# Altium project power_board.PrjPcb (part 2 of 6)

## Sheet DC_DC_MPPT.SchDoc
size A4; SheetNumber: 3; SheetTotal: 9
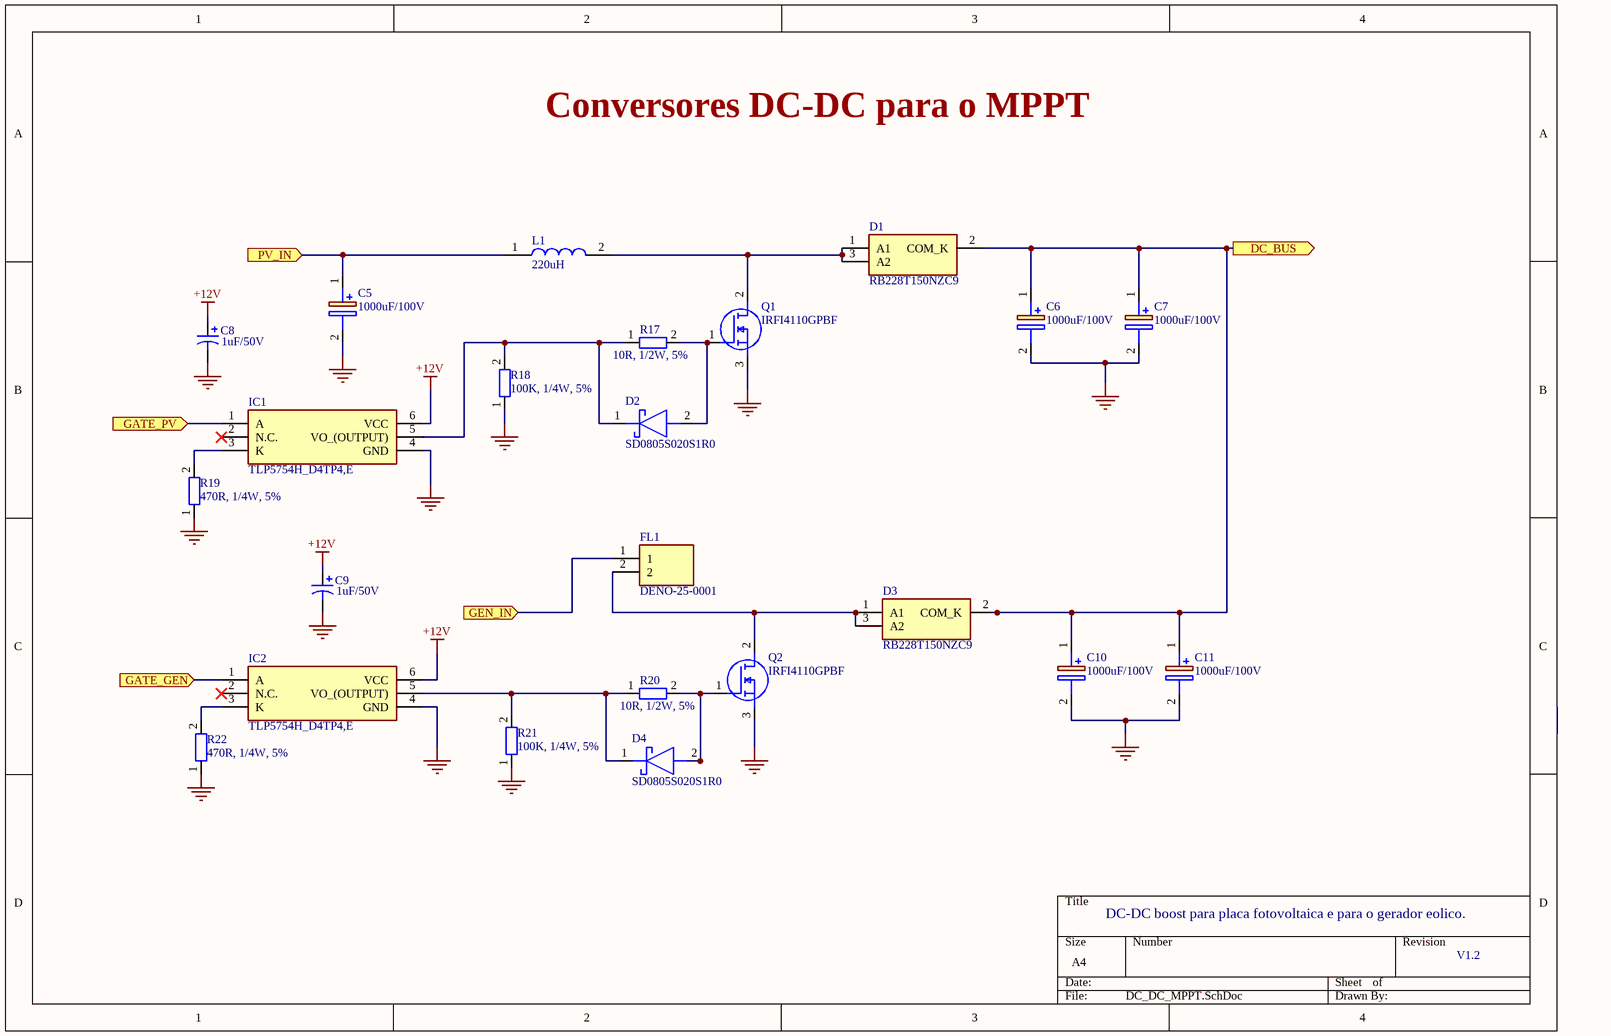
[diagram p2: DC_DC_MPPT.SchDoc]

### Parts
C5  1000uF/100V  [CAPPRD750W85D1800H3750]
C6  1000uF/100V  [CAPPRD750W85D1800H3750]
C7  1000uF/100V  [CAPPRD750W85D1800H3750]
C8  value 1uF/50V  [C1206]  (hidden comment: Cap Pol1)
C9  value 1uF/50V  [C1206]  (hidden comment: Cap Pol1)
C10  1000uF/100V  [CAPPRD750W85D1800H3750]
C11  1000uF/100V  [CAPPRD750W85D1800H3750]
D1  RB228T150NZC9  [TO254P480X1010X2100-3P]
D2  SD0805S020S1R0  [DIOM1613X100N]
D3  RB228T150NZC9  [TO254P480X1010X2100-3P]
D4  SD0805S020S1R0  [DIOM1613X100N]
FL1  DENO-25-0001  [DENO250001]
IC1  TLP5754H_D4TP4,E  [SOIC127P1105X230-6N]
IC2  TLP5754H_D4TP4,E  [SOIC127P1105X230-6N]
L1  220uH  [1140221KRC]
Q1  IRFI4110GPBF  [TO254P483X1018X2095-3P]
Q2  IRFI4110GPBF  [TO254P483X1018X2095-3P]
R17  10R, 1/2W, 5%  [RESC3216X60N]
R18  100K, 1/4W, 5%  [RES-0805]
R19  470R, 1/4W, 5%  [RES-0805]
R20  10R, 1/2W, 5%  [RESC3216X60N]
R21  100K, 1/4W, 5%  [RES-0805]
R22  470R, 1/4W, 5%  [RES-0805]

### Ports
DC_BUS (out), GATE_GEN (in), GATE_PV (in), GEN_IN (in), PV_IN (in)

### Nets
+12V: C8.1 C9.1 IC1.6(VCC) IC2.6(VCC)
GND: C5.2(-) C6.2(-) C7.2(-) C8.2 C9.2 C10.2(-) C11.2(-) IC1.4(GND) IC2.4(GND) Q1.3(S) Q2.3(S) R18.1 R19.1 R21.1 R22.1
DC BUS: C6.1(+) C7.1(+) C10.1(+) C11.1(+) D1.2(COM_K) D3.2(COM_K) ; port DC_BUS
NetC5_1: C5.1(+) L1.1 ; port PV_IN
NetD1_1: D1.1(A1) D1.3(A2) L1.2 Q1.2(D)
NetD2_1: D2.1(K) IC1.5(VO_(OUTPUT)) R17.1 R18.2
NetD2_2: D2.2(A) Q1.1(G) R17.2
NetD3_1: D3.1(A1) D3.3(A2) FL1.2 Q2.2(D)
NetD4_1: D4.1(K) IC2.5(VO_(OUTPUT)) R20.1 R21.2
NetD4_2: D4.2(A) Q2.1(G) R20.2
NetFL1_1: FL1.1 ; port GEN_IN
NetIC1_1: IC1.1(A) ; port GATE_PV
NetIC1_3: IC1.3(K) R19.2
NetIC2_1: IC2.1(A) ; port GATE_GEN
NetIC2_3: IC2.3(K) R22.2

Not connected (* = marked no-connect by the designer): IC1 2(N.C.)*; IC2 2(N.C.)*

### Notes on the sheet
- Conversores DC-DC para o MPPT
- DC-DC boost para placa fotovoltaica e para o gerador eolico.
- V1.2

### Library data of the parts
C5-C7 C10 C11 = ECA-2AHG102: Aluminum Electrolytic Capacitors - Leaded 1000uF 100V; Manufacturer_Name: Panasonic; Capacitance: 1mF; Tolerance: 20%; Ripple Current: 985mA; Leakage Current: 3uA; Life (Hours): 2000Hour; Dissipation Factor: 0.08%; Lead/Base Style: Straight; Lead Diameter: 0.8mm; Datasheet Link: http://www.mouser.com/ds/2/315/ABA0000C1215-1109177.pdf; Height: 37.5mm; Manufacturer_Part_Number: ECA-2AHG102; Mouser Part Number: 667-ECA-2AHG102; Mouser Price/Stock: https://www.mouser.co.uk/ProductDetail/Panasonic/ECA-2AHG102/?qs=rrcJgg%2Fw9KxYcZZHtVYgiQ%3D%3D; Arrow Part Number: ECA-2AHG102; Arrow Price/Stock: https://www.arrow.com/en/products/eca-2ahg102/panasonic; Supplier 1: Mouser; Supplier Part Number 1: 667-ECA-2AHG102; Manufacturer: Panasonic; Manufacturer Part Number: ECA-2AHG102; RoHS: Yes; Category: Aluminum Electrolytic Capacitors; Stock 1: 994; Pricing 1: 1=2.62000, 10=1.75000, 50=1.75000, 100=1.60000, 1000=1.07000, 10000=1.07000 (USD); Mount: Through Hole,PCB; Case/Package: Radial; Number of Pins: 2; Contact Plating: Tin; Min Operating Temperature: -55°C; Max Operating Temperature: 105°C; Termination: Radial; Voltage Rating: 100V; Packaging: Bulk; Package Quantity: 50; Voltage Rating (DC): 100V; Voltage: 100V; Series: NHG; Construction: RADIAL; Diameter: 18mm; Length: 35.5mm; Width: 18mm; Lead Pitch: 7.5mm; Height - Seated (Max): 1.476inch; Radiation Hardening: No; REACH SVHC: No SVHC; Lead Free: Lead Free; RoHS Compliant: Yes; ComponentLink1URL: https://datasheet.ciiva.com/2984/aba0000ce26-2984390.pdf?src-supplier=Avnet; ComponentLink1Description: https://datasheet.ciiva.com/2984/aba0000ce26-2984390.pdf?src-supplier=Avnet; ComponentLink2URL: https://datasheet.ciiva.com/43459/1790596-43459676.pdf?src-supplier=Farnell; ComponentLink2Description: https://datasheet.ciiva.com/43459/1790596-43459676.pdf?src-supplier=Farnell; ComponentLink3URL: https://datasheet.ciiva.com/24027/aba0000ce26-372437-24027279.pdf?src-supplier=Mouser; ComponentLink3Description: https://datasheet.ciiva.com/24027/aba0000ce26-372437-24027279.pdf?src-supplier=Mouser; ComponentLink4URL: https://datasheet.ciiva.com/30158/8aba0000ce26-30158524.pdf?src-supplier=Onlinecomponents.com; ComponentLink4Description: https://datasheet.ciiva.com/30158/8aba0000ce26-30158524.pdf?src-supplier=Onlinecomponents.com; ComponentLink5URL: https://datasheet.ciiva.com/16387/aba0000ce26-16387053.pdf?src-supplier=Future+Electronics; ComponentLink5Description: https://datasheet.ciiva.com/16387/aba0000ce26-16387053.pdf?src-supplier=Future+Electronics; ComponentLink6URL: https://datasheet.ciiva.com/14594/70067776-14594090.pdf?src-supplier=Allied+Electronics; ComponentLink6Description: https://datasheet.ciiva.com/14594/70067776-14594090.pdf?src-supplier=Allied+Electronics; ComponentLink7URL: https://datasheet.ciiva.com/15198/getdatasheetpartid-470872-15198006.pdf?src-supplier=Verical; ComponentLink7Description: https://datasheet.ciiva.com/15198/getdatasheetpartid-470872-15198006.pdf?src-supplier=Verical; ComponentLink8URL: https://datasheet.ciiva.com/17533/aba0000ce26-17533421.pdf?src-supplier=Avnet+Europe; ComponentLink8Description: https://datasheet.ciiva.com/17533/aba0000ce26-17533421.pdf?src-supplier=Avnet+Europe; ComponentLink9URL: https://datasheet.ciiva.com/29248/792491-da-01-en-elko-nhg-r-1000uf-100v-105c-29248620.pdf?src-supplier=Conrad; ComponentLink9Description: https://datasheet.ciiva.com/29248/792491-da-01-en-elko-nhg-r-1000uf-100v-105c-29248620.pdf?src-supplier=Conrad
C8 C9 = Cap Pol1: KEMET         T491A105K050AT            Surface Mount Tantalum Capacitor, T491 Series, 1 F,  10%, 50 V, 1206 [3216 Metric], A; Capacitance: 1uF; ESR (Equivalent Series Resistance): 7R; Voltage Rating: 50V; Polarity: Polar; Dissipation Factor: 4%; Published: 8-Jun-2000; LatestRevisionDate: 17-Jul-2002; LatestRevisionNote: Re-released for DXP Platform.; PackageReference: RB7.6-15; Publisher: Altium Limited; PackageDescription: Polarized Capacitor (Radial); 2 Leads; Supplier 1: Mouser; Supplier Part Number 1: 80-T491A105K050AT; Manufacturer: KEMET; Manufacturer Part Number: T491A105K050AT; RoHS: Yes; Category: Tantalum Capacitors; Stock 1: 5526; Pricing 1: 1=0.86000, 10=0.53600, 50=0.53600, 100=0.37800, 1000=0.31600, 10000=0.24700 (USD); Case/Package: Molded; Case Code (Metric): 3216; Case Code (Imperial): 1206; Min Operating Temperature: -55°C; Max Operating Temperature: 125°C; Tolerance: 10%; Packaging: Cut Tape; Voltage Rating (DC): 50V; Length: 3.2mm; Depth: 1.6mm; REACH SVHC: No SVHC; Lead Free: Lead Free; RoHS Compliant: Yes; ComponentLink1URL: https://datasheet.ciiva.com/7972/1854511-7972911.pdf?src-supplier=Element14; ComponentLink1Description: https://datasheet.ciiva.com/7972/1854511-7972911.pdf?src-supplier=Element14
D1 D3 = RB228T150NZC9: Schottky Diode; Manufacturer_Name: ROHM Semiconductor; Manufacturer: Rohm; Datasheet Link: https://fscdn.rohm.com/en/products/databook/datasheet/discrete/diode/schottky_barrier/rb228t150nz-e.pdf; Height: 4.8mm; Manufacturer_Part_Number: RB228T150NZC9; Supplier 1: Mouser; Supplier Part Number 1: 755-RB228T150NZC9; Manufacturer Part Number: RB228T150NZC9; RoHS: Yes; Stock 1: 962; Pricing 1: 1=1.74000, 10=1.48000, 50=1.48000, 100=1.14000, 1000=0.82400, 10000=0.78200 (USD)
D2 D4 = SD0805S020S1R0: Schottky Diodes & Rectifiers 20volts 1A SIZE 0805; Manufacturer_Name: AVX; Manufacturer: Kyocera AVX; Max Surge Current: 10A; Forward Voltage: 450mV; Max Reverse Current: 200uA; Max Repetitive Reverse Voltage (Vrrm): 20V; Element Configuration: Single; Datasheet Link: https://componentsearchengine.com/Datasheets/1/SD0805S020S1R0.pdf; Height: 1mm; Manufacturer_Part_Number: SD0805S020S1R0; Mouser Part Number: 581-SD0805S020S1R0; Mouser Price/Stock: https://www.mouser.co.uk/ProductDetail/AVX/SD0805S020S1R0/?qs=jCA%252BPfw4LHbpkAoSnwrdjw%3D%3D; Arrow Part Number: SD0805S020S1R0; Arrow Price/Stock: https://www.arrow.com/en/products/sd0805s020s1r0/avx; Supplier 1: Mouser; Supplier Part Number 1: 581-SD0805S020S1R0; Manufacturer Part Number: SD0805S020S1R0; RoHS: Yes; Category: Rectifier Diodes; Stock 1: 14821; Pricing 1: 1=0.38000, 10=0.29100, 50=0.29100, 100=0.17800, 1000=0.11300, 10000=0.08700 (USD); Mount: Surface Mount; Case/Package: 0805; Number of Pins: 2; Case Code (Metric): 2012; Case Code (Imperial): 0805; Min Operating Temperature: -55°C; Max Operating Temperature: 125°C; Packaging: Tape and Reel; Package Quantity: 3000; Forward Current: 1A; Average Rectified Current: 1A; Max Reverse Leakage Current: 200uA; Max Forward Surge Current (Ifsm): 10A; Peak Non-Repetitive Surge Current: 10A; Max Reverse Voltage (DC): 20V; Series: -; Radiation Hardening: No; REACH SVHC: No SVHC; RoHS Compliant: Yes; ComponentLink1URL: https://datasheet.ciiva.com/29883/schottky-29883740.pdf?src-supplier=Avnet; ComponentLink1Description: https://datasheet.ciiva.com/29883/schottky-29883740.pdf?src-supplier=Avnet; ComponentLink2URL: https://datasheet.ciiva.com/29883/schottky-29883741.pdf?src-supplier=Avnet; ComponentLink2Description: https://datasheet.ciiva.com/29883/schottky-29883741.pdf?src-supplier=Avnet; ComponentLink3URL: https://datasheet.ciiva.com/13084/schottky-221155-13084174.pdf?src-supplier=Mouser; ComponentLink3Description: https://datasheet.ciiva.com/13084/schottky-221155-13084174.pdf?src-supplier=Mouser
FL1 = DENO-25-0001: Fixed Inductors DENO Grnd wire choke 16A; Manufacturer_Name: SCHURTER; DC Resistance (DCR): 27mR; Inductance: 4mH; Lead/Base Style: Radial; Self Resonant Frequency: 300kHz; Shielding: Unshielded; Number of Lines: 1; Lead Diameter: 1.12mm; Datasheet Link: https://www.mouser.com/datasheet/2/358/typ_DENO-1276019.pdf; Height: 25mm; Manufacturer_Part_Number: DENO-25-0001; Mouser Part Number: 693-DENO-25-0001; Mouser Price/Stock: https://www.mouser.co.uk/ProductDetail/Schurter/DENO-25-0001?qs=A5k8bsa1loDfpdVSyZOXZg%3D%3D; Arrow Part Number: DENO-25-0001; Arrow Price/Stock: https://www.arrow.com/en/products/deno-25-0001/schurter; Supplier 1: Mouser; Supplier Part Number 1: 693-DENO-25-0001; Manufacturer: Schurter; Manufacturer Part Number: DENO-25-0001; RoHS: Yes; Category: Fixed Inductors; Stock 1: 326; Pricing 1: 1=4.79000, 10=4.25000, 50=3.83000, 100=3.62000, 1000=2.98000, 10000=2.87000 (USD); Mount: Through Hole,Radial; Case/Package: Radial; Weight: 0.83952oz; Min Operating Temperature: -25°C; Max Operating Temperature: 100°C; Max DC Current: 16A; Package Quantity: 50; Current Rating: 16A; Packaging: Bulk; Max Current Rating: 16A; DC Current: 16A; Termination: Radial; Series: DENO; Diameter: 25mm; Length: 0.984inch; Width: 0.709inch; Depth: 18mm; Radiation Hardening: No; Military Standard: Not; Lead Free: Lead Free; RoHS Compliant: Yes; ComponentLink1URL: https://datasheet.ciiva.com/25456/1832736-25456284.pdf?src-supplier=Newark; ComponentLink1Description: https://datasheet.ciiva.com/25456/1832736-25456284.pdf?src-supplier=Newark; ComponentLink2URL: https://datasheet.ciiva.com/17249/typ-deno-17249423.pdf?src-supplier=Avnet+Europe; ComponentLink2Description: https://datasheet.ciiva.com/17249/typ-deno-17249423.pdf?src-supplier=Avnet+Europe; ComponentLink3URL: https://datasheet.ciiva.com/6708/typ-deno-6708408.pdf?src-supplier=Digi-Key; ComponentLink3Description: https://datasheet.ciiva.com/6708/typ-deno-6708408.pdf?src-supplier=Digi-Key
IC1 IC2 = TLP5754H_D4TP4,E: Integrated Circuit; Manufacturer_Name: Toshiba; Manufacturer_Part_Number: TLP5754H(D4TP4,E; Datasheet Link: https://toshiba.semicon-storage.com/; Height: 2.3mm; Mouser Part Number: 757-TLP5754HD4TP4E; Mouser Price/Stock: https://www.mouser.co.uk/ProductDetail/Toshiba/TLP5754HD4TP4E?qs=BJlw7L4Cy78tX5u9MwNqOg%3D%3D; Supplier 1: Mouser; Supplier Part Number 1: 757-TLP5754HD4TP4E; Manufacturer: Toshiba; Manufacturer Part Number: TLP5754H(D4TP4,E; RoHS: Yes; Stock 1: 2749; Pricing 1: 1=2.13000, 10=1.86000, 50=1.83000, 100=1.09000, 1000=0.95600, 10000=0.73200 (USD)
L1 = 1140-221K-RC: BOURNS JW MILLER         1140-221K-RC             HIGH CURRENT CHOKE, 220UH 11.4A 10%; Core Material: Ferrite; Current Rating: 7.4A; Shielding: Unshielded; Saturation Current: 14A; DC Resistance (DCR): 50mR; Test Frequency: 1kHz; Lead/Base Style: Radial; Lead Diameter: 0.057inch; Lead Length: 12.7mm; Datasheet Link: https://www.mouser.com/datasheet/2/54/1140_series-776825.pdf; Height: 26.162mm; Manufacturer_Name: Bourns; Manufacturer_Part_Number: 1140-221K-RC; Mouser Part Number: 542-1140-221K-RC; Mouser Price/Stock: https://www.mouser.co.uk/ProductDetail/Bourns/1140-221K-RC?qs=Pac2tMOelJAp1Q7rw4D2Wg%3D%3D; Arrow Part Number: 1140-221K-RC; Arrow Price/Stock: https://www.arrow.com/en/products/1140-221k-rc/bourns; Supplier 1: Mouser; Manufacturer: Bourns JW Miller; Manufacturer Part Number: 1140-221K-RC; RoHS: Yes; Category: Fixed Inductors; Stock 1: 476; Pricing 1: 1=8.31000, 10=7.34000, 50=6.41000, 100=6.21000, 1000=5.66000, 10000=5.66000 (USD); Mount: Through Hole; Case/Package: Radial; Contact Plating: Tin; Min Operating Temperature: -55°C; Max Operating Temperature: 105°C; Packaging: Bulk; Tolerance: 10%; Inductance Tolerance: 10%; Package Quantity: 70; Resistor Type: Wirewound; Inductance: 220uH; Max DC Current: 11.4A; Termination: Radial; DC Current: 11.4A; RMS Current (Irms): 7.4A; Series: 1140; Diameter: 1.5inch; Length: 1.03inch; Lead Pitch: 29.21mm; Height - Seated (Max): 1.03inch; REACH SVHC: No SVHC; Military Standard: Not; Lead Free: Lead Free; ComponentLink1URL: https://datasheet.ciiva.com/13283/1140-series-61680-13283934.pdf?src-supplier=Mouser; ComponentLink1Description: https://datasheet.ciiva.com/13283/1140-series-61680-13283934.pdf?src-supplier=Mouser; ComponentLink2URL: https://datasheet.ciiva.com/5839/1140-series-5839095.pdf?src-supplier=Farnell; ComponentLink2Description: https://datasheet.ciiva.com/5839/1140-series-5839095.pdf?src-supplier=Farnell; ComponentLink3URL: https://datasheet.ciiva.com/6690/1140-series-6690681.pdf?src-supplier=Digi-Key; ComponentLink3Description: https://datasheet.ciiva.com/6690/1140-series-6690681.pdf?src-supplier=Digi-Key; ComponentLink4URL: https://datasheet.ciiva.com/30231/8931140-series-30231343.pdf?src-supplier=Onlinecomponents.com; ComponentLink4Description: https://datasheet.ciiva.com/30231/8931140-series-30231343.pdf?src-supplier=Onlinecomponents.com; ComponentLink5URL: https://datasheet.ciiva.com/1474/1140-series-1474528.pdf?src-supplier=Element14; ComponentLink5Description: https://datasheet.ciiva.com/1474/1140-series-1474528.pdf?src-supplier=Element14; Supplier Part Number 1: 542-1140-221K-RC
Q1 Q2 = IRFI4110GPBF: MOSFET N-CH 100V 72A TO220AB; Manufacturer_Name: Infineon; Rds On Max: 4.5mR; Input Capacitance: 9.54nF; Max Power Dissipation: 61W; Threshold Voltage: 4V; Datasheet Link: https://www.mouser.co.uk/datasheet/2/196/Infineon-IRFI4110G-DS-v01_02-EN-1227339.pdf; Height: 4.83mm; Manufacturer_Part_Number: IRFI4110GPBF; Mouser Part Number: 942-IRFI4110GPBF; Mouser Price/Stock: https://www.mouser.com/Search/Refine.aspx?Keyword=942-IRFI4110GPBF; Arrow Part Number: IRFI4110GPBF; Arrow Price/Stock: https://www.arrow.com/en/products/irfi4110gpbf/infineon-technologies-ag; Supplier 1: Mouser; Supplier Part Number 1: 942-IRFI4110GPBF; Manufacturer: Infineon; Manufacturer Part Number: IRFI4110GPBF; RoHS: Yes; Category: MOSFETs; Stock 1: 2175; Pricing 1: 1=3.400000, 10=2.890000, 100=2.310000, 500=2.060000, 1000=1.840000, 2000=1.840000 (USD); Mount: Through Hole; Case/Package: TO-220-3; Number of Pins: 3; Min Operating Temperature: -55°C; Max Operating Temperature: 175°C; Continuous Drain Current (ID): 72A; Packaging: Rail/Tube; Drain to Source Voltage (Vdss): 100V; Max Dual Supply Voltage: 100V; REACH SVHC: No SVHC; Lead Free: Lead Free; RoHS Compliant: Yes; Halogen Free: Halogen Free; ComponentLink1URL: http://www.infineon.com/dgdl/irfi4110gpbf.pdf?fileId=5546d462533600a401535623f28d1f78&src-supplier=Digi-Key; ComponentLink1Description: http://www.infineon.com/dgdl/irfi4110gpbf.pdf?fileId=5546d462533600a401535623f28d1f78&src-supplier=Digi-Key; ComponentLink2URL: http://www.farnell.com/datasheets/1302157.pdf?src-supplier=Element14; ComponentLink2Description: http://www.farnell.com/datasheets/1302157.pdf?src-supplier=Element14
R17 R20 = RES-1206: Res Thick Film 0805 10 Ohm 5% 0.5W(1/2W) +/-200ppm/C Pad SMD Automotive T/R; Manufacturer: Vishay Dale; Manufacturer Part Number: CRCW080510R0JNEAHP; Temperature Coefficient: 200ppm/°C; Power Rating: 330mW; Voltage Rating: 150V; Max Power Dissipation: 333mW; Supplier 1: Mouser; Supplier Part Number 1: 71-CRCW080510R0JNEAH; RoHS: Yes; Category: Chip SMD Resistors; Stock 1: 4777; Pricing 1: 1=0.23000, 10=0.20300, 50=0.20300, 100=0.07900, 1000=0.03000, 10000=0.02700 (USD); Mount: Surface Mount; Case/Package: 0805; Contact Plating: Tin; Weight: 0.000194oz; Case Code (Metric): 2012; Case Code (Imperial): 0805; Min Operating Temperature: -55°C; Max Operating Temperature: 155°C; Resistance: 10R; Tolerance: 5%; Resistor Type: Thick Film; Packaging: Tape and Reel; Package Quantity: 1; Number of Terminations: 2; Features: Automotive AEC-Q200; Series: CRCW-HP; Construction: Rectangular; Length: 2mm; Width: 0.049inch; Height: 0.024inch; Depth: 1.25mm; Radiation Hardening: No; Military Standard: Not; Lead Free: Lead Free; RoHS Compliant: Yes; ComponentLink1URL: https://datasheet.ciiva.com/2499/crcwhpe3-2499490.pdf?src-supplier=Digi-Key; ComponentLink1Description: https://datasheet.ciiva.com/2499/crcwhpe3-2499490.pdf?src-supplier=Digi-Key; ComponentLink2URL: https://datasheet.ciiva.com/2499/crcwhpe3-2499491.pdf?src-supplier=Digi-Key; ComponentLink2Description: https://datasheet.ciiva.com/2499/crcwhpe3-2499491.pdf?src-supplier=Digi-Key; ComponentLink3URL: https://datasheet.ciiva.com/2499/crcwhpe3-2499492.pdf?src-supplier=Digi-Key; ComponentLink3Description: https://datasheet.ciiva.com/2499/crcwhpe3-2499492.pdf?src-supplier=Digi-Key; ComponentLink4URL: https://datasheet.ciiva.com/5562/crcwhpe3-46056-5562181.pdf?src-supplier=Mouser; ComponentLink4Description: https://datasheet.ciiva.com/5562/crcwhpe3-46056-5562181.pdf?src-supplier=Mouser; ComponentLink5URL: https://datasheet.ciiva.com/9050/crcwhpe3-9050566.pdf?src-supplier=Avnet; ComponentLink5Description: https://datasheet.ciiva.com/9050/crcwhpe3-9050566.pdf?src-supplier=Avnet
R18 R21 = Res-0805: Thick Film Resistors 100K OHM 1%; Manufacturer_Name: YAGEO (PHYCOMP); Manufacturer_Part_Number: RC0805JR-131KL; Manufacturer: Yageo; Manufacturer Part Number: RC0805FR-13100KL; Resistance: 100kR; Temperature Coefficient: 100ppm/°C; Power Rating: 125mW; Voltage Rating: 150V; Datasheet Link: http://www.yageo.com/documents/recent/PYu-RC_Group_51_RoHS_L_10.pdf; Height: 0.6mm; Mouser Part Number: 603-RC0805JR-131KL; Mouser Price/Stock: https://www.mouser.com/Search/Refine.aspx?Keyword=603-RC0805JR-131KL; Supplier 1: Mouser; Supplier Part Number 1: 603-RC0805FR-13100KL; RoHS: Yes; Category: Chip SMD Resistors; Stock 1: 57591; Pricing 1: 1=0.13000, 10=0.03100, 50=0.03100, 100=0.01100, 1000=0.00800, 10000=0.00500 (USD); Case/Package: 0805; Contact Plating: Tin,Lead,Matte; Case Code (Imperial): 0805; Case Code (Metric): 2012; Size Code: 0805; Min Operating Temperature: -55°C; Max Operating Temperature: 155°C; Tolerance: 1%; Resistor Type: Thick Film; Packaging: Tape and Reel; Termination: SMD/SMT; Series: RC; Radiation Hardening: No; Lead Free: Lead Free; RoHS Compliant: Yes; ComponentLink1URL: https://datasheet.ciiva.com/5558/rc0805-5558047.pdf?src-supplier=Mouser; ComponentLink1Description: https://datasheet.ciiva.com/5558/rc0805-5558047.pdf?src-supplier=Mouser
R19 R22 = Res-0805: Thick Film Resistors - SMD 470 OHM 5%; Manufacturer_Name: YAGEO (PHYCOMP); Manufacturer_Part_Number: RC0805JR-131KL; Manufacturer: Yageo; Manufacturer Part Number: RC0805JR-13470RL; Temperature Coefficient: 100ppm/°C; Power Rating: 125mW; Voltage Rating: 150V; Datasheet Link: http://www.yageo.com/documents/recent/PYu-RC_Group_51_RoHS_L_10.pdf; Height: 0.6mm; Mouser Part Number: 603-RC0805JR-131KL; Mouser Price/Stock: https://www.mouser.com/Search/Refine.aspx?Keyword=603-RC0805JR-131KL; Supplier 1: Mouser; Supplier Part Number 1: 603-RC0805JR-13470RL; RoHS: Yes; Category: Chip SMD Resistors; Stock 1: 48513; Pricing 1: 1=0.12000, 10=0.01700, 50=0.01700, 100=0.00600, 1000=0.00500, 10000=0.00400 (USD); Case/Package: 0805; Contact Plating: Tin,Matte; Case Code (Imperial): 0805; Case Code (Metric): 2012; Min Operating Temperature: -55°C; Max Operating Temperature: 155°C; Resistance: 470R; Tolerance: 5%; Resistor Type: Thick Film; Packaging: Tape and Reel; Termination: SMD/SMT; Series: RC; Construction: Rectangular; Length: 2mm; Width: 1.25mm; Depth: 1.25mm; Radiation Hardening: No; Military Standard: Not; RoHS Compliant: Yes; ComponentLink1URL: http://www.mouser.com/ds/2/447/Yageo_08112016_RC0805-968729.pdf?src-supplier=Mouser; ComponentLink1Description: http://www.mouser.com/ds/2/447/Yageo_08112016_RC0805-968729.pdf?src-supplier=Mouser; ComponentLink2URL: http://components.arrow.com/part/dataview/0323_04018308?src-supplier=Arrow+Europe; ComponentLink2Description: http://components.arrow.com/part/dataview/0323_04018308?src-supplier=Arrow+Europe; ComponentLink3URL: http://www.yageo.com/documents/recent/PYu-RC0805_51_RoHS_L-(4).pdf?src-supplier=Avnet+Europe; ComponentLink3Description: http://www.yageo.com/documents/recent/PYu-RC0805_51_RoHS_L-(4).pdf?src-supplier=Avnet+Europe

## Sheet SenorsIn.SchDoc
size A4; SheetNumber: 2; SheetTotal: 9
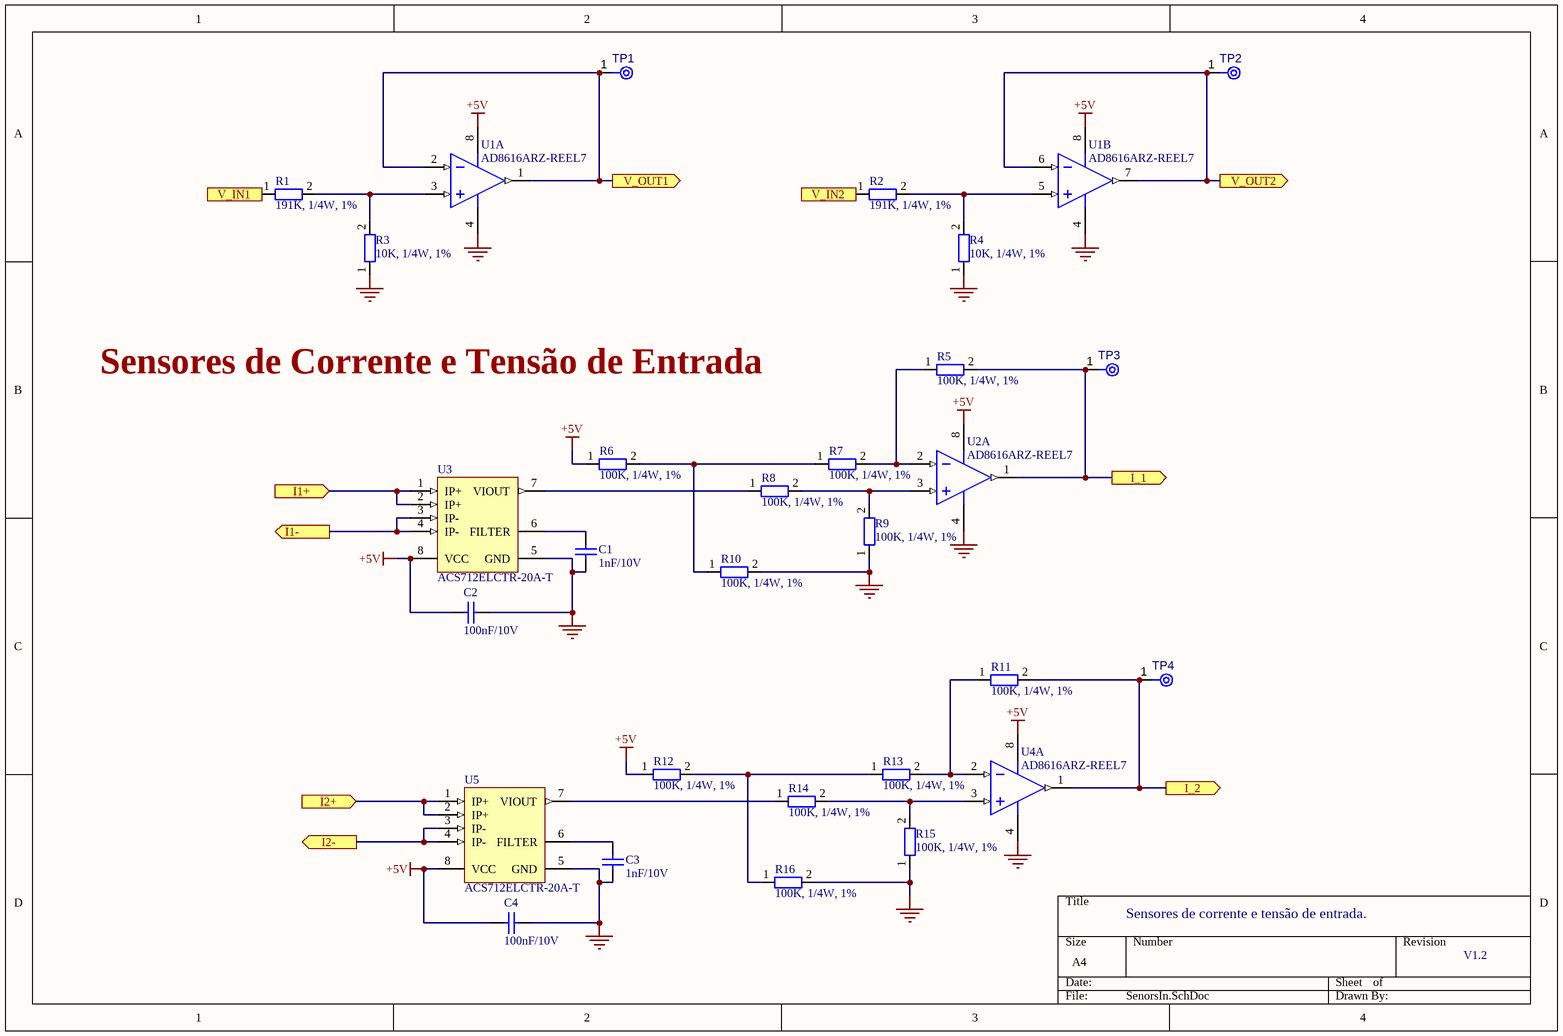
[diagram p3: SenorsIn.SchDoc]

### Parts
C1  value 1nF/10V  [C1206]  (hidden comment: Cap Semi)
C2  value 100nF/10V  [C1206]  (hidden comment: Cap Semi)
C3  value 1nF/10V  [C1206]  (hidden comment: Cap Semi)
C4  value 100nF/10V  [C1206]  (hidden comment: Cap Semi)
R1  191K, 1/4W, 1%  [RESC3216X60N]
R2  191K, 1/4W, 1%  [RESC3216X60N]
R3  10K, 1/4W, 1%  [RES-0805]
R4  10K, 1/4W, 1%  [RES-0805]
R5  100K, 1/4W, 1%  [RES-0805]
R6  100K, 1/4W, 1%  [RES-0805]
R7  100K, 1/4W, 1%  [RES-0805]
R8  100K, 1/4W, 1%  [RES-0805]
R9  100K, 1/4W, 1%  [RES-0805]
R10  100K, 1/4W, 1%  [RES-0805]
R11  100K, 1/4W, 1%  [RES-0805]
R12  100K, 1/4W, 1%  [RES-0805]
R13  100K, 1/4W, 1%  [RES-0805]
R14  100K, 1/4W, 1%  [RES-0805]
R15  100K, 1/4W, 1%  [RES-0805]
R16  100K, 1/4W, 1%  [RES-0805]
TP1  TPAD6R  [TP06R]  (value not drawn)  (no BOM)
TP2  TPAD6R  [TP06R]  (value not drawn)  (no BOM)
TP3  TPAD6R  [TP06R]  (value not drawn)  (no BOM)
TP4  TPAD6R  [TP06R]  (value not drawn)  (no BOM)
U1  AD8616ARZ-REEL7  [ADI-R-8_M]  (parts A,B of 2)
U2  AD8616ARZ-REEL7  [ADI-R-8_N]  (part A of 2)
U3  ACS712ELCTR-20A-T  [ALEG-LC-8_V]
U4  AD8616ARZ-REEL7  [ADI-R-8_N]  (part A of 2)
U5  ACS712ELCTR-20A-T  [ALEG-LC-8_V]

### Ports
I1+ (in), I1- (out), I2+ (in), I2- (out), I_1 (out), I_2 (out), V_IN1 (in), V_IN2 (in), V_OUT1 (out), V_OUT2 (out)

### Nets
+5V: C2.2 C4.2 R6.1 R12.1 U1.8(+V) U2.8(+V) U3.8(VCC) U4.8(+V) U5.8(VCC)
GND: C1.1 C2.1 C3.1 C4.1 R3.1 R4.1 R9.1 R10.2 R15.1 R16.2 U1.4(-V) U2.4(-V) U3.5(GND) U4.4(-V) U5.5(GND)
NetC1_2: C1.2 U3.6(FILTER)
NetC3_2: C3.2 U5.6(FILTER)
NetC5_1: U5.3(IP-) U5.4(IP-) ; port I2-
NetC15_1: R1.1 U3.1(IP+) U3.2(IP+) ; port I1+, port V_IN1
NetFL1_1: U3.3(IP-) U3.4(IP-) ; port I1-
NetJ7_2: R2.1 U5.1(IP+) U5.2(IP+) ; port I2+, port V_IN2
NetR1_2: R1.2 R3.2 U1.3(+IN_A)
NetR2_2: R2.2 R4.2 U1.5(+IN_B)
NetR5_1: R5.1 R7.2 U2.2(-IN_A)
NetR5_2: R5.2 TP3.1(TP) U2.1(OUT_A) ; port I_1
NetR6_2: R6.2 R7.1 R10.1
NetR8_1: R8.1 U3.7(VIOUT)
NetR8_2: R8.2 R9.2 U2.3(+IN_A)
NetR11_1: R11.1 R13.2 U4.2(-IN_A)
NetR11_2: R11.2 TP4.1(TP) U4.1(OUT_A) ; port I_2
NetR12_2: R12.2 R13.1 R16.1
NetR14_1: R14.1 U5.7(VIOUT)
NetR14_2: R14.2 R15.2 U4.3(+IN_A)
NetTP1_1: TP1.1(TP) U1.1(OUT_A) U1.2(-IN_A) ; port V_OUT1
NetTP2_1: TP2.1(TP) U1.6(-IN_B) U1.7(OUT_B) ; port V_OUT2

### Notes on the sheet
- Sensores de Corrente e Tensão de Entrada
- Sensores de corrente e tensão de entrada.
- V1.2

### Library data of the parts
C1 C3 = Cap Semi: KEMET - C0805C102K8RACTU - MLCC CAPACITOR, 1000PF, 10V, X7R, 10%, 0805, FULL REEL; Dielectric Material: Ceramic; Capacitance: 1nF; Published: 8-Jun-2000; LatestRevisionDate: 29-May-2009; LatestRevisionNote: IPC-7351 Footprint Added.; PackageReference: C1206; Publisher: Altium Limited; PackageDescription: Chip Capacitor; Supplier 1: Mouser; Supplier Part Number 1: 80-C0805C102K8R; Manufacturer: KEMET; Manufacturer Part Number: C0805C102K8RACTU; RoHS: Yes; Category: Ceramic Capacitors; Stock 1: 10223; Pricing 1: 1=0.30000, 10=0.15600, 50=0.15600, 100=0.09300, 1000=0.07300, 10000=0.05100 (USD); Mount: Surface Mount; Case/Package: 0805; Case Code (Metric): 2012; Case Code (Imperial): 0805; Contact Plating: Tin,Matte; Min Operating Temperature: -55°C; Max Operating Temperature: 125°C; Voltage Rating: 10V; Tolerance: 10%; Packaging: Tape and Reel; Package Quantity: 1; Voltage Rating (DC): 10V; Dielectric: X7R; Termination: SMD/SMT; Series: C; Construction: Flat; Length: 2mm; Width: 0.049inch; Height: 0.78mm; Thickness: 0.035inch; REACH SVHC: No SVHC; RoHS Compliant: Yes; ComponentLink1URL: http://www.mouser.com/ds/2/212/KEM_C1002_X7R_SMD-1102033.pdf?src-supplier=Mouser; ComponentLink1Description: http://www.mouser.com/ds/2/212/KEM_C1002_X7R_SMD-1102033.pdf?src-supplier=Mouser; ComponentLink2URL: https://search.kemet.com/component-edge/download/datasheet/C0805C102K8RACTU.pdf?src-supplier=Digi-Key; ComponentLink2Description: https://search.kemet.com/component-edge/download/datasheet/C0805C102K8RACTU.pdf?src-supplier=Digi-Key; ComponentLink3URL: https://api.kemet.com/component-edge/download/datasheet/C0805C102K8RACTU.pdf?src-supplier=Digi-Key; ComponentLink3Description: https://api.kemet.com/component-edge/download/datasheet/C0805C102K8RACTU.pdf?src-supplier=Digi-Key; ComponentLink4URL: http://capacitoredge.kemet.com/capedge2/DataSheet?pn=C0805C102K8RACTU&src-supplier=Avnet; ComponentLink4Description: http://capacitoredge.kemet.com/capedge2/DataSheet?pn=C0805C102K8RACTU&src-supplier=Avnet; ComponentLink5URL: http://www.farnell.com/datasheets/2627200.pdf?src-supplier=Newark; ComponentLink5Description: http://www.farnell.com/datasheets/2627200.pdf?src-supplier=Newark
C2 C4 = Cap Semi: Multilayer Ceramic Capacitors MLCC - SMD/SMT 10volts 0.1uF X7R 20%; Manufacturer: KEMET; Manufacturer Part Number: C1206C104M8RACTU; Capacitance: 100nF; Voltage Rating: 10V; Published: 8-Jun-2000; LatestRevisionDate: 29-May-2009; LatestRevisionNote: IPC-7351 Footprint Added.; PackageReference: C1206; Publisher: Altium Limited; PackageDescription: Chip Capacitor; Supplier 1: Mouser; Supplier Part Number 1: 80-C1206C104M8R; RoHS: Yes; Category: Ceramic Capacitors; Stock 1: 1591; Pricing 1: 1=0.41000, 10=0.24000, 50=0.24000, 100=0.15000, 1000=0.12000, 10000=0.08000 (USD); Mount: Surface Mount; Case/Package: 1206; Case Code (Metric): 3216; Case Code (Imperial): 1206; Weight: 0.000571oz; Dielectric Material: Ceramic; Min Operating Temperature: -55°C; Max Operating Temperature: 125°C; Package Quantity: 4000; Tolerance: 20%; Packaging: Tape and Reel; Voltage Rating (DC): 10V; Dielectric: X7R; Termination: SMD/SMT; Series: C; Construction: Flat; Length: 3.2mm; Width: 0.063inch; Height: 0.78mm; Thickness: 0.035inch; Depth: 1.6mm; RoHS Compliant: Yes; ComponentLink1URL: http://www.mouser.com/ds/2/212/KEM_C1002_X7R_SMD-1102033.pdf?src-supplier=Mouser; ComponentLink1Description: http://www.mouser.com/ds/2/212/KEM_C1002_X7R_SMD-1102033.pdf?src-supplier=Mouser; ComponentLink2URL: http://components.arrow.com/part/dataview/3457921S8615974N7429?src-supplier=Arrow+Electronics; ComponentLink2Description: http://components.arrow.com/part/dataview/3457921S8615974N7429?src-supplier=Arrow+Electronics; ComponentLink3URL: https://search.kemet.com/component-edge/download/datasheet/C1206C104M8RACTU.pdf?src-supplier=Digi-Key; ComponentLink3Description: https://search.kemet.com/component-edge/download/datasheet/C1206C104M8RACTU.pdf?src-supplier=Digi-Key
R1 R2 = RES-1206: Res Thick Film 1206 191K Ohm 1% 0.25W(1/4W) ±100ppm/C Molded SMD Paper T/R; Manufacturer: Yageo; Manufacturer Part Number: RC1206FR-07191KL; Resistance: 191kR; Temperature Coefficient: 100ppm/°C; Power Rating: 250mW; Voltage Rating: 200V; Supplier 1: Mouser; Supplier Part Number 1: 603-RC1206FR-07191KL; RoHS: Yes; Category: Chip SMD Resistors; Stock 1: 10616; Pricing 1: 1=0.23000, 10=0.05400, 50=0.05400, 100=0.01900, 1000=0.01400, 10000=0.00800 (USD); Case/Package: 1206; Contact Plating: Tin,Matte; Case Code (Imperial): 1206; Case Code (Metric): 3216; Weight: 0.000571oz; Min Operating Temperature: -55°C; Max Operating Temperature: 155°C; Tolerance: 1%; Resistor Type: Thick Film; Packaging: Tape and Reel; Termination: SMD/SMT; Voltage Rating (DC): 200V; Features: Moisture Resistant; Series: RC; Max Power Dissipation: 250mW; Number of Terminations: 2; Construction: Rectangular; Length: 3.2mm; Width: 1.6mm; Height: 0.55mm; Depth: 1.6mm; Radiation Hardening: No; Military Standard: Not; Lead Free: Lead Free; RoHS Compliant: Yes; ComponentLink1URL: http://www.mouser.com/ds/2/447/PYu-RC1206_51_RoHS_L-4-349080.pdf?src-supplier=Mouser; ComponentLink1Description: http://www.mouser.com/ds/2/447/PYu-RC1206_51_RoHS_L-4-349080.pdf?src-supplier=Mouser; ComponentLink2URL: http://components.arrow.com/part/dataview/0323_00047427?src-supplier=Arrow+Europe; ComponentLink2Description: http://components.arrow.com/part/dataview/0323_00047427?src-supplier=Arrow+Europe; ComponentLink3URL: http://www.yageo.com/documents/recent/PYu-RC_Group_51_RoHS_L_2.pdf?src-supplier=Avnet; ComponentLink3Description: http://www.yageo.com/documents/recent/PYu-RC_Group_51_RoHS_L_2.pdf?src-supplier=Avnet; ComponentLink4URL: http://www.yageo.com.tw/exep/pages/download/literatures/PYu-R_INT-thick_7.pdf?src-supplier=Digi-Key; ComponentLink4Description: http://www.yageo.com.tw/exep/pages/download/literatures/PYu-R_INT-thick_7.pdf?src-supplier=Digi-Key; ComponentLink5URL: http://www.yageo.com/documents/recent/PYu-RC_Group_51_RoHS_L_9.pdf?src-supplier=Digi-Key; ComponentLink5Description: http://www.yageo.com/documents/recent/PYu-RC_Group_51_RoHS_L_9.pdf?src-supplier=Digi-Key; ComponentLink6URL: http://www.yageo.com/documents/recent/PYu-RC_Group_51_RoHS_L_10.pdf?src-supplier=Digi-Key; ComponentLink6Description: http://www.yageo.com/documents/recent/PYu-RC_Group_51_RoHS_L_10.pdf?src-supplier=Digi-Key; ComponentLink7URL: http://www.yageo.com/documents/recent/PYu-RC1206_51_RoHS_L_5.pdf?src-supplier=Avnet+Europe; ComponentLink7Description: http://www.yageo.com/documents/recent/PYu-RC1206_51_RoHS_L_5.pdf?src-supplier=Avnet+Europe
R3 R4 = Res-0805: Res Thick Film 2.0 x 1.2 mm 10K Ohm 1% 0.125W(1/8W) 100ppm/ C Molded SMD Paper T/R; Manufacturer_Name: YAGEO (PHYCOMP); Manufacturer_Part_Number: RC0805JR-131KL; Manufacturer: Yageo; Manufacturer Part Number: RC0805FR-1310KL; Resistance: 10kR; Temperature Coefficient: 100ppm/°C; Power Rating: 125mW; Voltage Rating: 150V; Datasheet Link: http://www.yageo.com/documents/recent/PYu-RC_Group_51_RoHS_L_10.pdf; Height: 0.6mm; Mouser Part Number: 603-RC0805JR-131KL; Mouser Price/Stock: https://www.mouser.com/Search/Refine.aspx?Keyword=603-RC0805JR-131KL; Supplier 1: Mouser; Supplier Part Number 1: 603-RC0805FR-1310KL; RoHS: Yes; Category: Chip SMD Resistors; Stock 1: 16417; Pricing 1: 1=0.13000, 10=0.03100, 50=0.03100, 100=0.01100, 1000=0.00800, 10000=0.00500 (USD); Case/Package: 0805; Number of Pins: 2; Contact Plating: Tin,Matte,Lead; Case Code (Imperial): 0805; Case Code (Metric): 2012; Min Operating Temperature: -55°C; Max Operating Temperature: 155°C; Tolerance: 1%; Resistor Type: Thick Film; Packaging: Tape and Reel; Termination: SMD/SMT; Voltage Rating (DC): 150V; Series: RC; Resistance Tolerance: 1%; Radiation Hardening: No; REACH SVHC: No SVHC; Lead Free: Lead Free; RoHS Compliant: Yes; ComponentLink1URL: http://www.farnell.com/datasheets/2167052.pdf?src-supplier=Farnell; ComponentLink1Description: http://www.farnell.com/datasheets/2167052.pdf?src-supplier=Farnell; ComponentLink2URL: http://www.mouser.com/ds/2/447/Yageo_08112016_RC0805-968729.pdf?src-supplier=Mouser; ComponentLink2Description: http://www.mouser.com/ds/2/447/Yageo_08112016_RC0805-968729.pdf?src-supplier=Mouser; ComponentLink3URL: http://components.arrow.com/part/dataview/0323_00200993?src-supplier=Arrow+Europe; ComponentLink3Description: http://components.arrow.com/part/dataview/0323_00200993?src-supplier=Arrow+Europe; ComponentLink4URL: http://www.yageo.com/pdf/PYu-RC0805_51_RoHS_L_4.pdf?src-supplier=Avnet; ComponentLink4Description: http://www.yageo.com/pdf/PYu-RC0805_51_RoHS_L_4.pdf?src-supplier=Avnet; ComponentLink5URL: http://www.yageo.com/documents/recent/PYu-RC0805_51_RoHS_L_5.pdf?src-supplier=Avnet+Europe; ComponentLink5Description: http://www.yageo.com/documents/recent/PYu-RC0805_51_RoHS_L_5.pdf?src-supplier=Avnet+Europe; ComponentLink6URL: http://www.farnell.com/datasheets/2167052.pdf?src-supplier=Element14; ComponentLink6Description: http://www.farnell.com/datasheets/2167052.pdf?src-supplier=Element14; ComponentLink7URL: http://www.farnell.com/datasheets/2167052.pdf?src-supplier=Newark; ComponentLink7Description: http://www.farnell.com/datasheets/2167052.pdf?src-supplier=Newark
R5-R16 = Res-0805: Res Thick Film 0805 100K Ohm 1% 1/4W ±200ppm/°C Molded SMD Paper T/R; Manufacturer_Name: YAGEO (PHYCOMP); Manufacturer_Part_Number: RC0805JR-131KL; Manufacturer: Yageo; Manufacturer Part Number: RC0805FR-7W100KL; Datasheet Link: http://www.yageo.com/documents/recent/PYu-RC_Group_51_RoHS_L_10.pdf; Height: 0.6mm; Mouser Part Number: 603-RC0805JR-131KL; Mouser Price/Stock: https://www.mouser.com/Search/Refine.aspx?Keyword=603-RC0805JR-131KL; Supplier 1: Mouser; Supplier Part Number 1: 603-RC0805FR-7W100KL; RoHS: Yes; Category: Chip SMD Resistors; Stock 1: 8375; Pricing 1: 1=0.18000, 10=0.11500, 50=0.11500, 100=0.03700, 1000=0.02600, 10000=0.02600 (USD); RoHS Compliant: Yes
TP1-TP4 = CMP-00028-00002-2: 0.6mm round; Pins: 1
U1 U2 U4 = CMP-0384-00618-1: Double Channel Wide Bandwidth Operational Amplifier, 24 MHz BW, 12 V/us SR, Industrial, 8-pin SOIC (R-8), Reel; Generic Part Number: AD8616; Manufacturer: Analog Devices; Amplifiers Per Package: 2; Iq/Amp: 2mA; Small Signal Bandwidth: 24MHz; V Span Max: 6V; Input Offset Voltage: 23uV; Input Bias Current: 200fA; V Span Min: 2.7V; Slew Rate: 12V/us; Common Mode Rejection Ratio: 100dB; Max Supply Voltage: 5V; Voltage Gain: 123.52dB; Operating Supply Voltage: 3V; Input Offset Voltage (Vos): 60uV; Operating Supply Current: 4mA; Output Current per Channel: 150mA; Input Voltage Noise Density: 10nV/sqrt Hz; Power Supply Rejection Ratio (PSRR): 90dB; Input Capacitance: 10pF; Settling Time: 500ns; Amplifier Type: GENERAL PURPOSE; ComponentLink2Description: Datasheet; ComponentLink1URL: http://www.analog.com/en/index.html; PackageDescription: 8-Pin Standard Small Outline Package, Body 3.9 x 4.9 mm, Pitch 1.27 mm; Code_JEDEC: MS-012-AA; PackageReference: R-8; Mounting Technology: Surface Mount; ComponentLink2URL: http://www.analog.com/static/imported-files/data_sheets/AD8615_8616_8618.pdf; ComponentLink3Description: Package Specification; PackageVersion: 060506-A; ComponentLink1Description: Manufacturer URL; ComponentLink3URL: http://www.analog.com/static/imported-files/packages/PKG_PDF/SOIC_Narrow%20(R)/R_8.pdf; DatasheetVersion: Rev. E; PartNumber: AD8616ARZ-REEL7; Supplier 1: Mouser; Supplier Part Number 1: 584-AD8616ARZ-R7; Manufacturer Part Number: AD8616ARZ-REEL7; RoHS: Yes; Category: Amplifiers - Op Amps, Buffer, Instrumentation; Pricing 1: 1=3.82000, 10=3.44000, 50=3.25000, 100=2.82000, 1000=2.03000, 10000=1.97000 (USD); Case/Package: R; Number of Pins: 8; Contact Plating: Tin,Matte; Min Operating Temperature: -40°C; Max Operating Temperature: 125°C; Min Supply Voltage: 2.7V; Gain Bandwidth Product: 24MHz; Packaging: Tape and Reel; Unity Gain Bandwidth Product: 24MHz; Package Quantity: 1; Number of Circuits: 2; Number of Channels: 2; Number of Elements: 2; Max Supply Current: 4mA; Quiescent Current: 2mA; Number of Amplifiers: 2; Series: DigiTrim®; Technology: CMOS; Length: 5mm; Width: 4mm; Height: 1.5mm; Lead Free: Contains Lead; RoHS Compliant: Yes; ComponentLink4URL: https://datasheet.ciiva.com/15374/ad8615-8616-8618-243269-15374309.pdf?src-supplier=Mouser; ComponentLink4Description: https://datasheet.ciiva.com/15374/ad8615-8616-8618-243269-15374309.pdf?src-supplier=Mouser; ComponentLink5URL: https://datasheet.ciiva.com/11711/ad8615-8616-8618-11711337.pdf?src-supplier=Avnet; ComponentLink5Description: https://datasheet.ciiva.com/11711/ad8615-8616-8618-11711337.pdf?src-supplier=Avnet; ComponentLink6URL: https://datasheet.ciiva.com/6629/ad8615-8616-8618-6629773.pdf?src-supplier=Digi-Key; ComponentLink6Description: https://datasheet.ciiva.com/6629/ad8615-8616-8618-6629773.pdf?src-supplier=Digi-Key; ComponentLink7URL: https://datasheet.ciiva.com/6629/ad8615-8616-8618-6629775.pdf?src-supplier=Digi-Key; ComponentLink7Description: https://datasheet.ciiva.com/6629/ad8615-8616-8618-6629775.pdf?src-supplier=Digi-Key; ComponentLink8URL: https://datasheet.ciiva.com/17569/ad8615-8616-8618-17569678.pdf?src-supplier=Avnet+Europe; ComponentLink8Description: https://datasheet.ciiva.com/17569/ad8615-8616-8618-17569678.pdf?src-supplier=Avnet+Europe
U3 U5 = CMP-0826-00001-1: Linear Current Sensor IC, 4.5 to 5.5 V Supply Voltage, 10 mA Supply Current, -40 to 85 degC, 8-Pin SOIC (LC), RoHS, Tape and Reel; Manufacturer: Allegro Microsystems; CLOAD: 10 nF Max.; ICC: 10 mA; F: 80 kHz; RLOAD: 4.7 kOhm Min.; Optimized Accuracy Range: +/- 20 A; TR: 3.5 us; Sensitivity Sens: 100 mV/A Typ.; Operating Supply Voltage: 5V; Output Current: 10mA; Max Supply Current: 13mA; Min Supply Voltage: 4.5V; Max Supply Voltage: 5.5V; Bandwidth: 80kHz; Number of Channels: 1; Response Time: 5us; Polarity: Bidirectional; Accuracy: 1.5%; Current Sensing: 20A; Sensitivity: 100mV/A; Operating Temperature Range: -40 to 85 degC; ComponentLink2URL: http://www.allegromicro.com/~/media/Files/Datasheets/ACS712-Datasheet.ashx; ComponentLink1Description: Manufacturer URL; VCC: 4.5 to 5.5 V; Mounting Technology: Surface Mount; DatasheetVersion: Rev. 15; ComponentLink2Description: Datasheet; ComponentLink1URL: http://www.allegromicro.com/; PackageDescription: 8-Pin SOIC, Body 4.9 x 3.9 mm, Pitch 1.27 mm; PackageReference: LC-8; RoHS: TRUE; Packing: Tape and Reel; PartNumber: ACS712ELCTR-20A-T; Supplier 1: Newark; Supplier Part Number 1: 31M3133; Manufacturer Part Number: ACS712ELCTR-20A-T; Category: Magnetic Sensors; Stock 1: 1560; Pricing 1: 1=5.64000, 25=3.57000, 50=3.15000, 100=3.07000, 250=2.82000, 500=2.57000 (USD); Case/Package: SOIC; Number of Pins: 8; Min Operating Temperature: -40°C; Max Operating Temperature: 85°C; Package Quantity: 1; Frequency: 80kHz; Packaging: Tape and Reel; Termination: SMD/SMT; Quiescent Current: 10mA; Linearity: 1.5%; Series: -; Length: 4.9mm; Width: 3.9mm; Height: 1.5mm; Radiation Hardening: No; REACH SVHC: No SVHC; Lead Free: Lead Free; RoHS Compliant: Yes; ComponentLink3URL: https://datasheet.ciiva.com/15099/getdatasheetpartid-312820-15099471.pdf?src-supplier=Verical; ComponentLink3Description: https://datasheet.ciiva.com/15099/getdatasheetpartid-312820-15099471.pdf?src-supplier=Verical; ComponentLink4URL: https://datasheet.ciiva.com/3271/acs712-datasheet-3271995.pdf?src-supplier=Avnet; ComponentLink4Description: https://datasheet.ciiva.com/3271/acs712-datasheet-3271995.pdf?src-supplier=Avnet; ComponentLink5URL: https://datasheet.ciiva.com/3272/acs712-datasheet-3272423.pdf?src-supplier=Avnet; ComponentLink5Description: https://datasheet.ciiva.com/3272/acs712-datasheet-3272423.pdf?src-supplier=Avnet; ComponentLink6URL: https://datasheet.ciiva.com/16636/acs712-datasheet-16636599.pdf?src-supplier=Avnet+Europe; ComponentLink6Description: https://datasheet.ciiva.com/16636/acs712-datasheet-16636599.pdf?src-supplier=Avnet+Europe; ComponentLink7URL: https://datasheet.ciiva.com/1165/64754-1165093.pdf?src-supplier=Element14; ComponentLink7Description: https://datasheet.ciiva.com/1165/64754-1165093.pdf?src-supplier=Element14

## Sheet Microcontroller.SchDoc
size A4; SheetNumber: 6; SheetTotal: 9
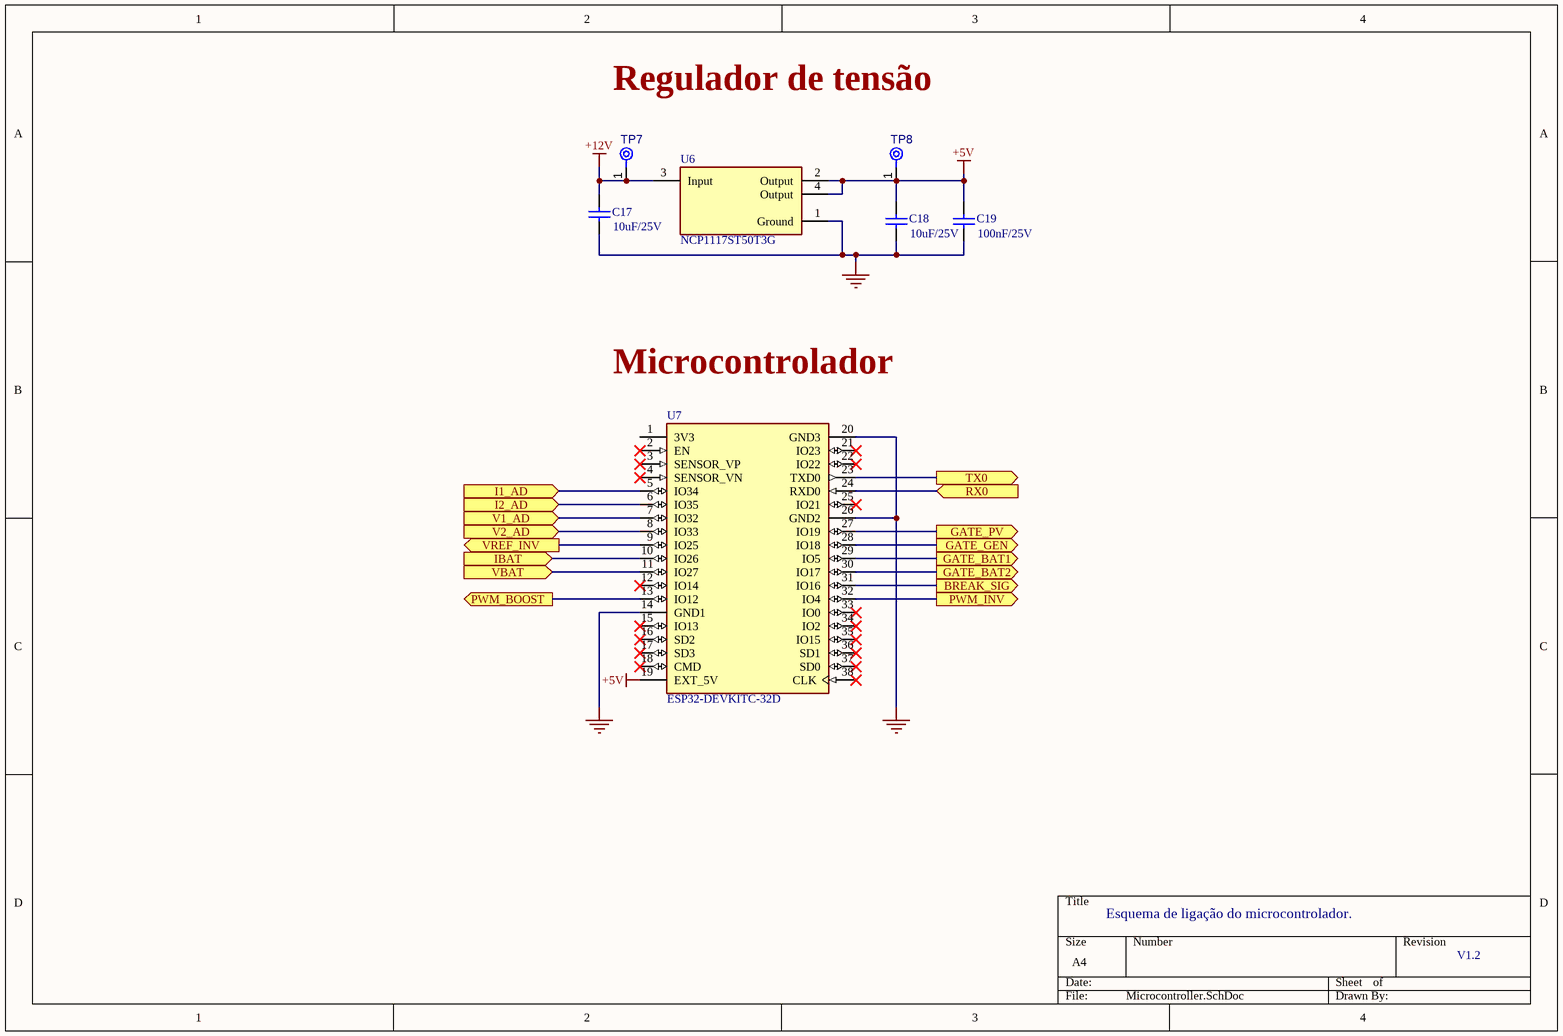
[diagram p4: Microcontroller.SchDoc]

### Parts
C17  value 10uF/25V  [C1206]  (hidden comment: Cap Semi)
C18  value 10uF/25V  [C1206]  (hidden comment: Cap Semi)
C19  value 100nF/25V  [C1206]  (hidden comment: Cap Semi)
TP7  TPAD6R  [TP06R]  (value not drawn)  (no BOM)
TP8  TPAD6R  [TP06R]  (value not drawn)  (no BOM)
U6  NCP1117ST50T3G  [FP-318H-MFG]
U7  ESP32-DEVKITC-32D  [MODULE_ESP32-DEVKITC-32D]

### Ports
BREAK_SIG (out), GATE_BAT1 (out), GATE_BAT2 (out), GATE_GEN (out), GATE_PV (out), I1_AD (in), I2_AD (in), IBAT (in), PWM_BOOST (out), PWM_INV (out), RX0 (in), TX0 (out), V1_AD (in), V2_AD (in), VBAT (in), VREF_INV (out)

### Nets
+5V: C18.2 C19.2 TP8.1(TP) U6.2(Output) U6.4(Output) U7.19(EXT_5V)
+12V: C17.2 TP7.1(TP) U6.3(Input)
GND: C17.1 C18.1 C19.1 U6.1(Ground) U7.14(GND1) U7.20(GND3) U7.26(GND2)
BRAKE: U7.31(IO16) ; port BREAK_SIG
IBAT: U7.10(IO26) ; port IBAT
VBAT: U7.11(IO27) ; port VBAT
NetIC1_1: U7.27(IO19) ; port GATE_PV
NetIC2_1: U7.28(IO18) ; port GATE_GEN
NetIC3_1: U7.29(IO5) ; port GATE_BAT1
NetIC4_1: U7.30(IO17) ; port GATE_BAT2
NetIC7_1: U7.13(IO12) ; port PWM_BOOST
NetJ10_3: U7.23(TXD0) ; port TX0
NetJ10_4: U7.24(RXD0) ; port RX0
NetR5_2: U7.5(IO34) ; port I1_AD
NetR11_2: U7.6(IO35) ; port I2_AD
NetR32_1: U7.32(IO4) ; port PWM_INV
NetTP1_1: U7.7(IO32) ; port V1_AD
NetTP2_1: U7.8(IO33) ; port V2_AD
NetU7_9: U7.9(IO25) ; port VREF_INV

Not connected (* = marked no-connect by the designer): U7 1(3V3) 2(EN)* 3(SENSOR_VP)* 4(SENSOR_VN)* 12(IO14)* 15(IO13)* 16(SD2)* 17(SD3)* 18(CMD)* 21(IO23)* 22(IO22)* 25(IO21)* 33(IO0)* 34(IO2)* 35(IO15)* 36(SD1)* 37(SD0)* 38(CLK)*

### Notes on the sheet
- Regulador de tensão
- Microcontrolador
- Esquema de ligação do microcontrolador.
- V1.2

### Library data of the parts
C17 C18 = Cap Semi: Cap Ceramic 10uF 25V X7R 20% Pad SMD 1206 125C Automotive T/R; Manufacturer: KEMET; Manufacturer Part Number: C1206C106M3RACAUTO; Core Material: Air; Inductance: 1.8nH; Current Rating: 1A; Shielding: Unshielded; DC Resistance (DCR): 40mR; Self Resonant Frequency: 9GHz; Test Frequency: 100MHz; Published: 8-Jun-2000; LatestRevisionDate: 29-May-2009; LatestRevisionNote: IPC-7351 Footprint Added.; PackageReference: C1206; Publisher: Altium Limited; PackageDescription: Chip Capacitor; Supplier 1: Mouser; Supplier Part Number 1: 80-C1206C106M3RAUTO; RoHS: Yes; Category: Ceramic Capacitors; Stock 1: 16243; Pricing 1: 1=0.78000, 10=0.42000, 50=0.42000, 100=0.36600, 1000=0.23000, 10000=0.23000 (USD); Mount: Surface Mount; Case/Package: 1206; Case Code (Imperial): 0402; Case Code (Metric): 1005; Min Operating Temperature: -55°C; Max Operating Temperature: 125°C; Packaging: Cut Tape; Capacitance: 10uF; Tolerance: 20%; Voltage Rating: 25V; Ratings: AEC-Q200; RoHS Compliant: Yes; ComponentLink1URL: http://www.farnell.com/datasheets/2741398.pdf?src-supplier=Farnell; ComponentLink1Description: http://www.farnell.com/datasheets/2741398.pdf?src-supplier=Farnell; ComponentLink2URL: https://api.kemet.com/component-edge/download/datasheet/C1206C106M3RACAUTO.pdf?src-supplier=Digi-Key; ComponentLink2Description: https://api.kemet.com/component-edge/download/datasheet/C1206C106M3RACAUTO.pdf?src-supplier=Digi-Key; ComponentLink3URL: http://www.farnell.com/datasheets/2741398.pdf?src-supplier=Newark; ComponentLink3Description: http://www.farnell.com/datasheets/2741398.pdf?src-supplier=Newark
C19 = Cap Semi: CAP CER 1206 0.1UF 25V C0G 5%; Manufacturer: KEMET; Manufacturer Part Number: C1206C104J3GEC7210; Capacitance: 100nF; Published: 8-Jun-2000; LatestRevisionDate: 29-May-2009; LatestRevisionNote: IPC-7351 Footprint Added.; PackageReference: C1206; Publisher: Altium Limited; PackageDescription: Chip Capacitor; Supplier 1: Mouser; Supplier Part Number 1: 80-C1206C104J3GECLR; RoHS: Yes; Stock 1: 29008; Pricing 1: 1=0.98000, 10=0.65400, 50=0.65400, 100=0.40700, 1000=0.30800, 10000=0.25300 (USD); Mount: Surface Mount; Case/Package: 1206; Min Operating Temperature: -55°C; Max Operating Temperature: 125°C; Packaging: Tape and Reel; Tolerance: 5%; Voltage Rating: 25V; RoHS Compliant: Yes; ComponentLink1URL: https://api.kemet.com/component-edge/download/datasheet/C1206C104J3GEC7210.pdf?src-supplier=Digi-Key; ComponentLink1Description: https://api.kemet.com/component-edge/download/datasheet/C1206C104J3GEC7210.pdf?src-supplier=Digi-Key
TP7 TP8 = CMP-00028-00002-2: 0.6mm round; Pins: 1
U6 = CMP-0592-00001-4: IC REG LINEAR 5V 1A SOT223; Manufacturer: ON Semiconductor; Output Voltage Accuracy: 1%; Number of Outputs: 1; Dropout Voltage: 1.2V; Polarity: Positive; Power Rating: 781mW; Input Bias Current: 6mA; Quiescent Current: 10mA; Output Type: Fixed; Max Input Voltage: 20V; Min Input Voltage: 3.5V; Max Operating Temperature: 125°C; Number of Pins: 4; Case/Package: SOT-223; Min Operating Temperature: 0°C; Accuracy: 1%; Contact Plating: Tin; Min Current Limit: 1A; Output Current: 1A; Max Output Current: 1A; Length: 6.7mm; Packaging: Tape and Reel; Package Quantity: 1; Height: 1.69mm; REACH SVHC: No SVHC; Width: 3.7mm; Halogen Free: Halogen Free; RoHS Compliant: Yes; Nominal Output Voltage: 5V; Lead Free: Lead Free; Radiation Hardening: No; Tolerance: 1%; Number of Regulators: 1; Output Voltage: 5V; Supplier 1: Mouser; Supplier Part Number 1: 863-NCP1117ST50T3G; Manufacturer Part Number: NCP1117ST50T3G; RoHS: Yes; Category: Voltage Regulators - Linear; Stock 1: 312; Pricing 1: 1=0.56000, 10=0.47900, 50=0.47900, 100=0.33200, 1000=0.21700, 10000=0.17400 (USD); ComponentLink1URL: https://datasheet.ciiva.com/28483/1748260-28483320.pdf?src-supplier=Element14; ComponentLink1Description: https://datasheet.ciiva.com/28483/1748260-28483320.pdf?src-supplier=Element14; ComponentLink2URL: https://datasheet.ciiva.com/2042/ncp1117-d-2042018.pdf?src-supplier=Digi-Key; ComponentLink2Description: https://datasheet.ciiva.com/2042/ncp1117-d-2042018.pdf?src-supplier=Digi-Key; ComponentLink3URL: https://datasheet.ciiva.com/2042/ncp1117-d-2042019.pdf?src-supplier=Digi-Key; ComponentLink3Description: https://datasheet.ciiva.com/2042/ncp1117-d-2042019.pdf?src-supplier=Digi-Key; ComponentLink4URL: https://datasheet.ciiva.com/2042/ncp1117-d-2042020.pdf?src-supplier=Digi-Key; ComponentLink4Description: https://datasheet.ciiva.com/2042/ncp1117-d-2042020.pdf?src-supplier=Digi-Key; ComponentLink5URL: https://datasheet.ciiva.com/8231/ncp1117-d-8231068.pdf?src-supplier=Avnet; ComponentLink5Description: https://datasheet.ciiva.com/8231/ncp1117-d-8231068.pdf?src-supplier=Avnet; ComponentLink6URL: https://datasheet.ciiva.com/8233/ncp1117-d-8233593.pdf?src-supplier=Avnet; ComponentLink6Description: https://datasheet.ciiva.com/8233/ncp1117-d-8233593.pdf?src-supplier=Avnet; ComponentLink7URL: https://datasheet.ciiva.com/16491/ncp1117-d-16491895.pdf?src-supplier=Avnet+Asia; ComponentLink7Description: https://datasheet.ciiva.com/16491/ncp1117-d-16491895.pdf?src-supplier=Avnet+Asia; ComponentLink8URL: https://datasheet.ciiva.com/16209/ncp1117-d-16209561.pdf?src-supplier=Future+Electronics; ComponentLink8Description: https://datasheet.ciiva.com/16209/ncp1117-d-16209561.pdf?src-supplier=Future+Electronics; ComponentLink9URL: https://datasheet.ciiva.com/8073/ncp1117-d-8073736.pdf?src-supplier=Element14; ComponentLink9Description: https://datasheet.ciiva.com/8073/ncp1117-d-8073736.pdf?src-supplier=Element14; ComponentLink10URL: https://datasheet.ciiva.com/8073/ncp1117-d-8073902.pdf?src-supplier=Element14; ComponentLink10Description: https://datasheet.ciiva.com/8073/ncp1117-d-8073902.pdf?src-supplier=Element14; ComponentLink11URL: https://datasheet.ciiva.com/25978/ncp1117-d-25978293.pdf?src-supplier=Avnet+Europe; ComponentLink11Description: https://datasheet.ciiva.com/25978/ncp1117-d-25978293.pdf?src-supplier=Avnet+Europe
U7 = ESP32-DEVKITC-32D: Espressif Systems ESP32-DevKitC Microcontroller; Frequency: 2.5GHz; Interface: USB; Operating Supply Voltage: 5V; Value: *; MP: ESP32-DEVKITC-32D; Price: None; Check_prices: https://www.snapeda.com/parts/ESP32-DEVKITC-32D/Espressif%20Systems/view-part/2777395/?ref=eda; MF: Espressif Systems; SnapEDA_Link: https://www.snapeda.com/parts/ESP32-DEVKITC-32D/Espressif%20Systems/view-part/2777395/?ref=snap; Availability: Warning; Purchase-URL: https://pricing.snapeda.com/search/part/ESP32-DEVKITC-32D/?ref=eda; Package: None; Supplier 1: Mouser; Supplier Part Number 1: 356-ESP32-DEVKITC32D; Manufacturer: Espressif Systems; Manufacturer Part Number: ESP32-DEVKITC-32D; RoHS: No; Stock 1: 1492; Pricing 1: 1=10.00000, 10=10.00000, 50=10.00000, 100=10.00000, 1000=10.00000, 10000=10.00000 (USD); Package Quantity: 1; ComponentLink1URL: https://datasheet.ciiva.com/70828/esp32-devkit-70828764.pdf?src-supplier=TME; ComponentLink1Description: https://datasheet.ciiva.com/70828/esp32-devkit-70828764.pdf?src-supplier=TME

## Sheet Inverter.SchDoc
size A3; SheetNumber: 7; SheetTotal: 9
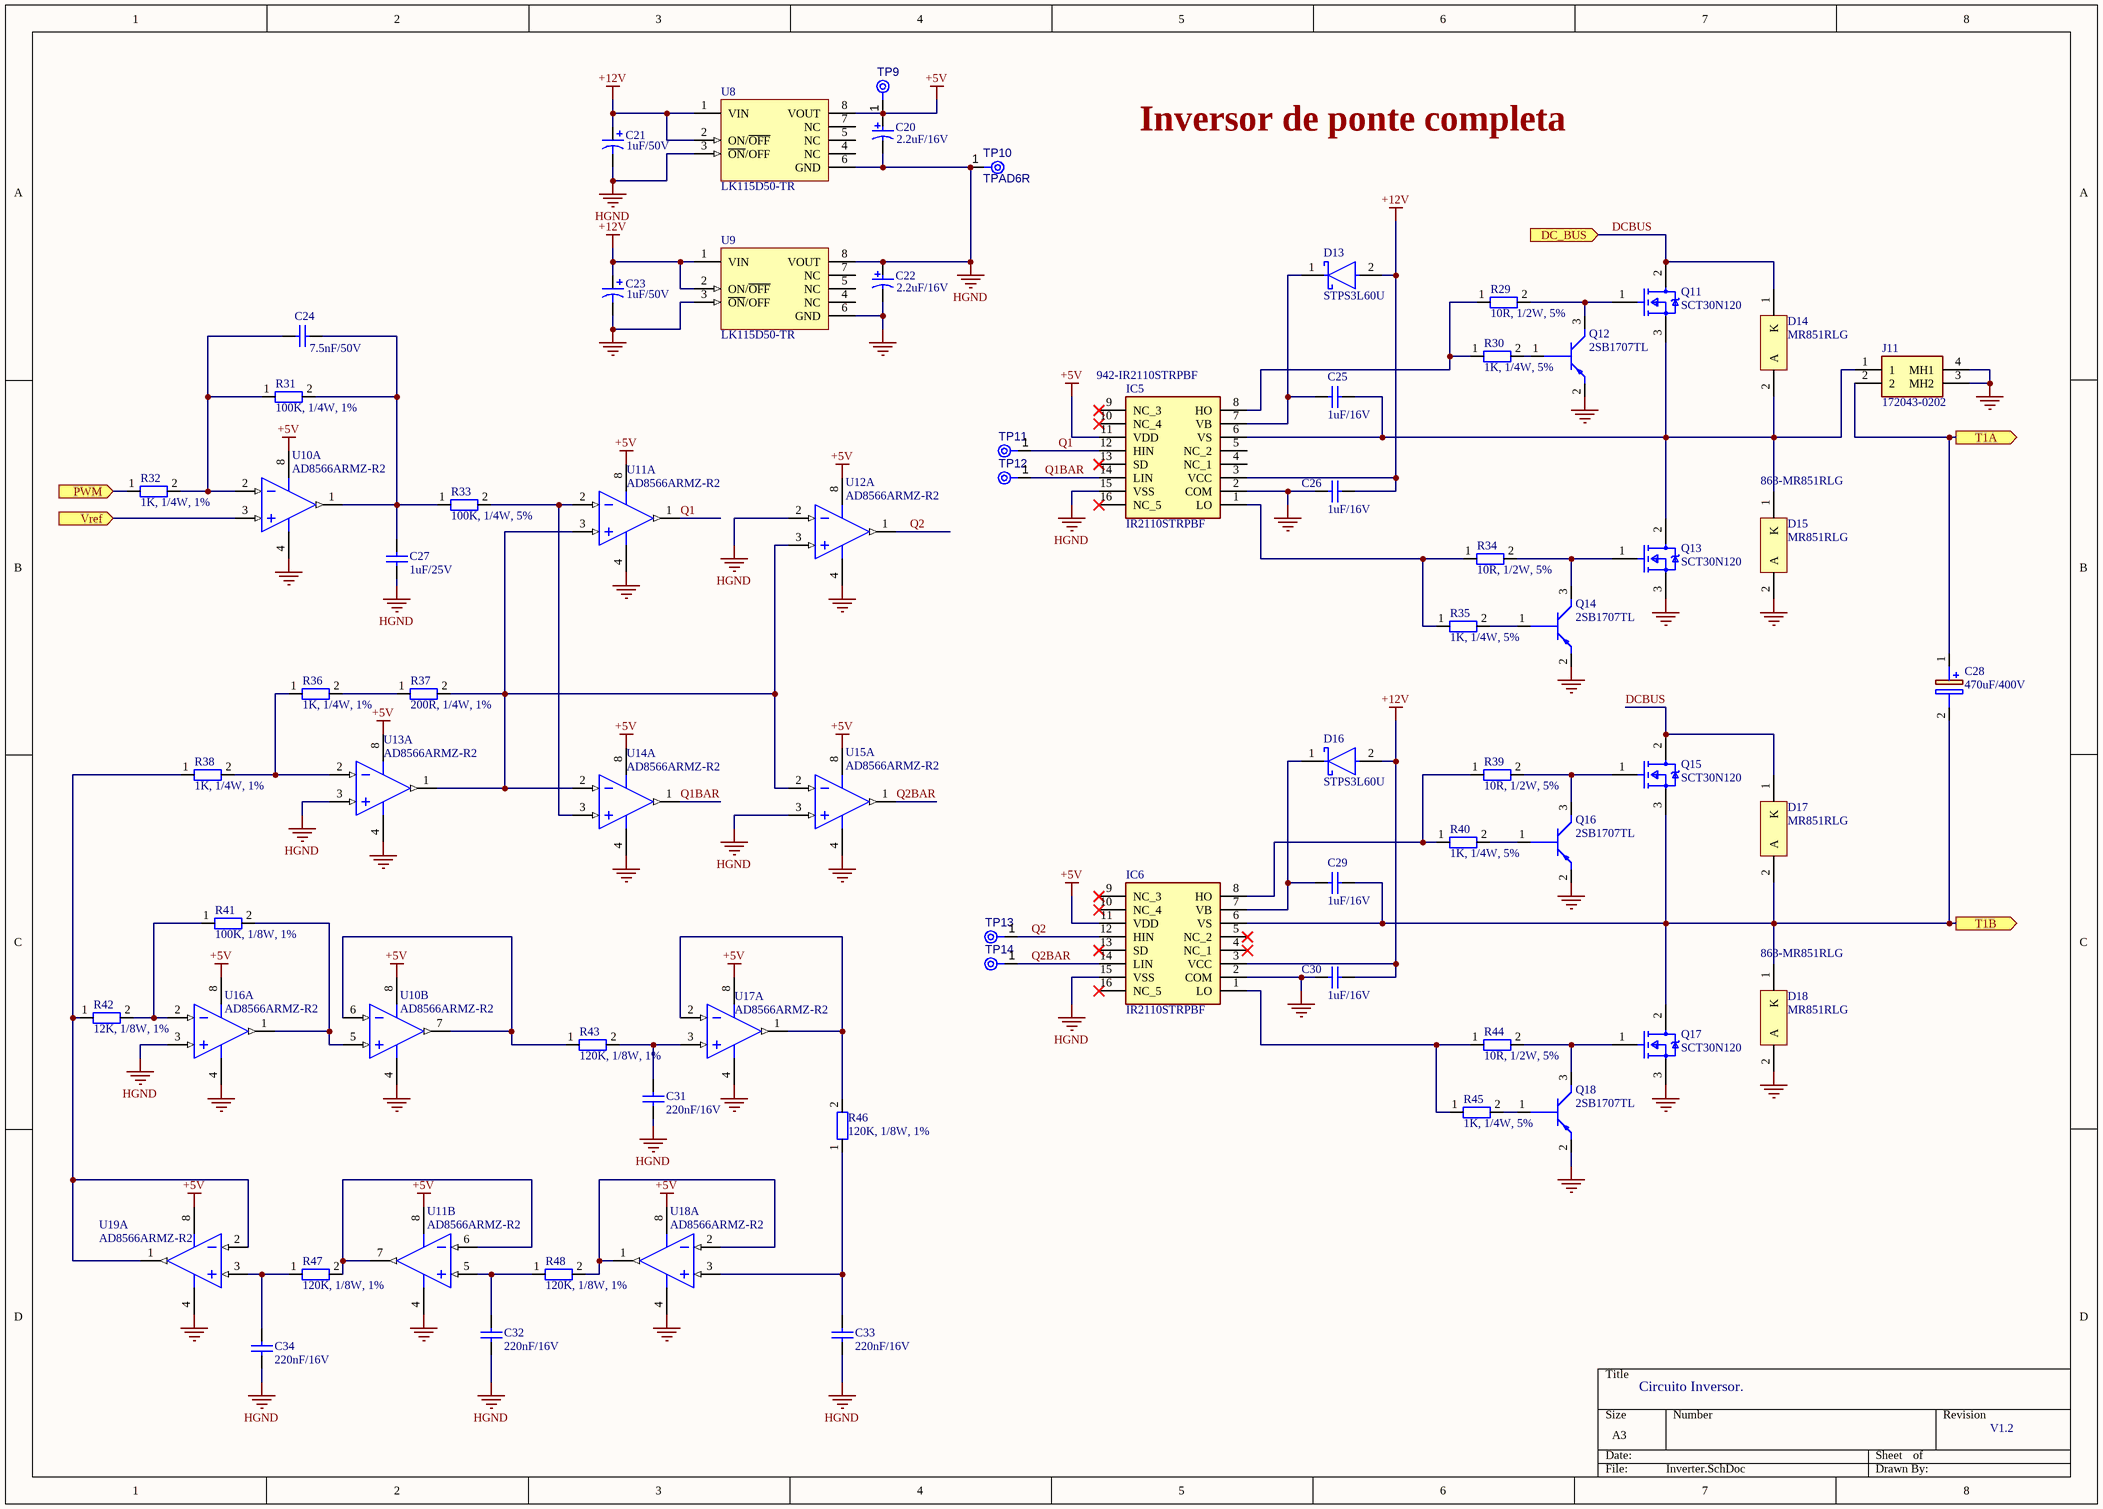
[diagram p5: Inverter.SchDoc]